# Altium schematic sheet microcontroller.SchDoc
size A4; SheetNumber: 3; SheetTotal: 7; NameOfSheet: Microcontroller
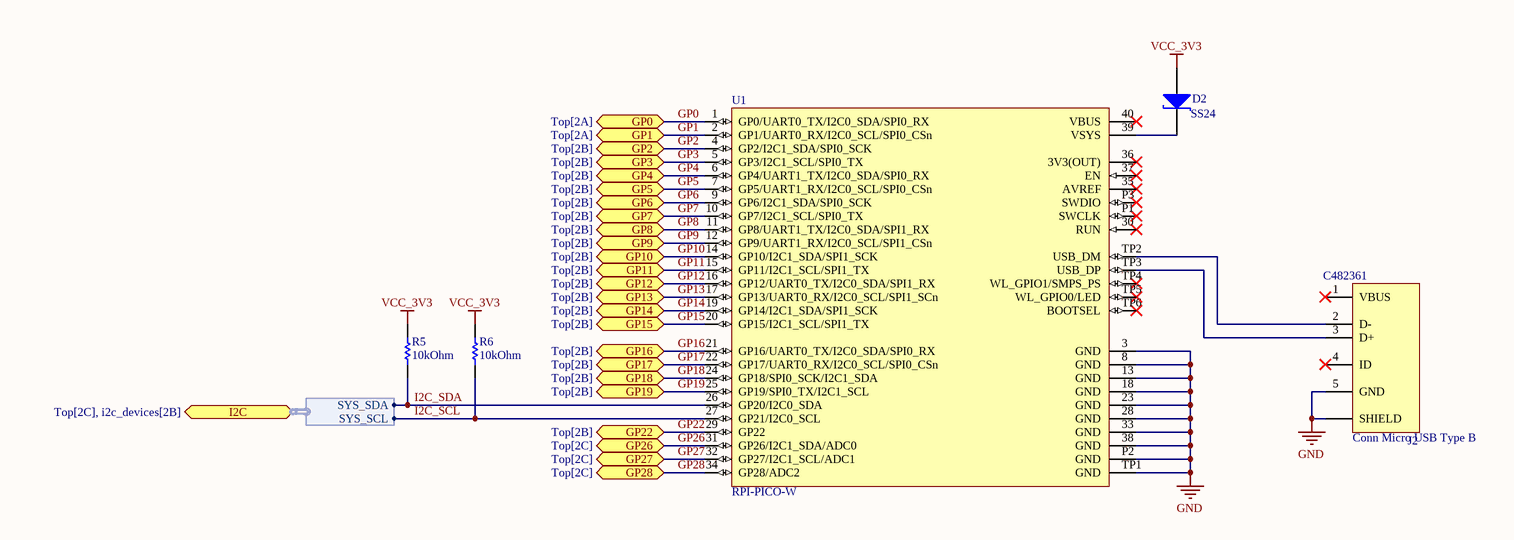
[diagram p0: microcontroller.SchDoc]

## Parts
D2  SS24  [DO214AA]
J2  Name: Conn Micro USB Type B  Supplier Part Number 1: C482361  [10118193-0001LF]  (hidden comment: 10118193-0001LF)
R5  Resistance: 10kOhm  [RES_0603]  (hidden comment: 0603 10kOhm 1%)
R6  Resistance: 10kOhm  [RES_0603]  (hidden comment: 0603 10kOhm 1%)
U1  RPI-PICO-W  [RPI-PICO-W]

## Ports
GP0 (bidir, see Top[2A]), GP1 (bidir, see Top[2A]), GP2 (bidir, see Top[2B]), GP3 (bidir, see Top[2B]), GP4 (bidir, see Top[2B]), GP5 (bidir, see Top[2B]), GP6 (bidir, see Top[2B]), GP7 (bidir, see Top[2B]), GP8 (bidir, see Top[2B]), GP9 (bidir, see Top[2B]), GP10 (bidir, see Top[2B]), GP11 (bidir, see Top[2B]), GP12 (bidir, see Top[2B]), GP13 (bidir, see Top[2B]), GP14 (bidir, see Top[2B]), GP15 (bidir, see Top[2B]), GP16 (bidir, see Top[2B]), GP17 (bidir, see Top[2B]), GP18 (bidir, see Top[2B]), GP19 (bidir, see Top[2B]), GP22 (bidir, see Top[2B]), GP26 (bidir, see Top[2C]), GP27 (bidir, see Top[2C]), GP28 (bidir, see Top[2C]), I2C (bidir, harness I2C_SYS2, see Top[2C], i2c_devices[2B])

## Harnesses
I2C_SYS2: SYS_SCL, SYS_SDA

## Nets
GND: J2.5(GND) J2.S1(SHIELD) U1.3(GND) U1.8(GND) U1.13(GND) U1.18(GND) U1.23(GND) U1.28(GND) U1.33(GND) U1.38(GND) U1.P2(GND) U1.TP1(GND)
VCC_3V3: D2.A R5.1 R6.1
GP0: U1.1(GP0/UART0_TX/I2C0_SDA/SPI0_RX) ; port GP0
GP1: U1.2(GP1/UART0_RX/I2C0_SCL/SPI0_CSn) ; port GP1
GP2: U1.4(GP2/I2C1_SDA/SPI0_SCK) ; port GP2
GP3: U1.5(GP3/I2C1_SCL/SPI0_TX) ; port GP3
GP4: U1.6(GP4/UART1_TX/I2C0_SDA/SPI0_RX) ; port GP4
GP5: U1.7(GP5/UART1_RX/I2C0_SCL/SPI0_CSn) ; port GP5
GP6: U1.9(GP6/I2C1_SDA/SPI0_SCK) ; port GP6
GP7: U1.10(GP7/I2C1_SCL/SPI0_TX) ; port GP7
GP8: U1.11(GP8/UART1_TX/I2C0_SDA/SPI1_RX) ; port GP8
GP9: U1.12(GP9/UART1_RX/I2C0_SCL/SPI1_CSn) ; port GP9
GP10: U1.14(GP10/I2C1_SDA/SPI1_SCK) ; port GP10
GP11: U1.15(GP11/I2C1_SCL/SPI1_TX) ; port GP11
GP12: U1.16(GP12/UART0_TX/I2C0_SDA/SPI1_RX) ; port GP12
GP13: U1.17(GP13/UART0_RX/I2C0_SCL/SPI1_SCn) ; port GP13
GP14: U1.19(GP14/I2C1_SDA/SPI1_SCK) ; port GP14
GP15: U1.20(GP15/I2C1_SCL/SPI1_TX) ; port GP15
GP16: U1.21(GP16/UART0_TX/I2C0_SDA/SPI0_RX) ; port GP16
GP17: U1.22(GP17/UART0_RX/I2C0_SCL/SPI0_CSn) ; port GP17
GP18: U1.24(GP18/SPI0_SCK/I2C1_SDA) ; port GP18
GP19: U1.25(GP19/SPI0_TX/I2C1_SCL) ; port GP19
GP22: U1.29(GP22) ; port GP22
GP26: U1.31(GP26/I2C1_SDA/ADC0) ; port GP26
GP27: U1.32(GP27/I2C1_SCL/ADC1) ; port GP27
GP28: U1.34(GP28/ADC2) ; port GP28
I2C_SCL: R6.2 U1.27(GP21/I2C0_SCL) ; port I2C.SYS_SCL
I2C_SDA: R5.2 U1.26(GP20/I2C0_SDA) ; port I2C.SYS_SDA
NetD2_K: D2.K U1.39(VSYS)
NetJ2_2: J2.2(D-) U1.TP2(USB_DM)
NetJ2_3: J2.3(D+) U1.TP3(USB_DP)

Not connected (* = marked no-connect by the designer): J2 1(VBUS)* 4(ID)*; U1 30(RUN)* 35(AVREF)* 36(3V3(OUT))* 37(EN)* 40(VBUS)* P1(SWCLK)* P3(SWDIO)* TP4(WL_GPIO1/SMPS_PS)* TP5(WL_GPIO0/LED)* TP6(BOOTSEL)*

## Notes on the sheet
- Author:
- Sheet:
- /
- Issue date:
- Project name:
- Revision:
- Date:
- Page name:

## Library data of the parts
D2 = Dioda prostownicza Schottky: 40V Single 500mV@2A 2A DO-214AA Schottky Barrier Diodes (SBD) ROHS; Typ obudowy: SMA; Opis: Dioda prostownicza Schottky; Wartość: SS24; Supplier 1: LCSC; Supplier Part Number 1: C2845097
J2 = 10118193-0001LF: Conn Micro USB Type B RCP 5 POS 0.65mm Solder RA SMD 5 Terminal 1 Port T/R; Supplier 1: LCSC
R5 R6 = Resistor SMD_1: Generic Resistor SMD; Manufacturer Part Number: 0603 10kOhm 1%; Supplier 1: LCSC; Supplier Part Number 1: C3017715
U1 = RPI-PICO-W: Raspberry Pi Pico W - RP2040 ARM Cortex M0+ CYW43439; Manufacturer: Raspberry Pi Foundation; Manufacturer Part No: SC0915; Mounting Technology: SMT; Supplier: DigiKey; Supplier Part No: 2648-SC0915CT-ND; Supplier Link: https://www.digikey.com/en/products/detail/raspberry-pi/SC0915/13684020